# EAGLE design Volt4-leds (EAGLE 7.2.0)
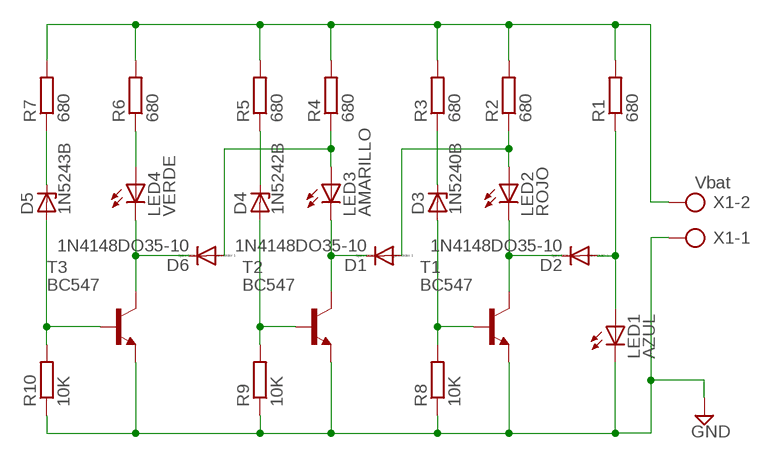
[diagram p0: schematic, sheet 1]

## Parts
D1  1N4148DO35-10  [DO35-10]
D2  1N4148DO35-10  [DO35-10]
D3  1N5240B  ZENER-DIODEDO35Z10  [DO35Z10]
D4  1N5242B  ZENER-DIODEDO35Z10  [DO35Z10]
D5  1N5243B  ZENER-DIODEDO35Z10  [DO35Z10]
D6  1N4148DO35-10  [DO35-10]
LED1  AZUL  LED3MM  [LED3MM]
LED2  ROJO  LED3MM  [LED3MM]
LED3  AMARILLO  LED3MM  [LED3MM]
LED4  VERDE  LED3MM  [LED3MM]
R1  680  R-EU_0207/10  [0207/10]
R2  680  R-EU_0207/10  [0207/10]
R3  680  R-EU_0207/10  [0207/10]
R4  680  R-EU_0207/10  [0207/10]
R5  680  R-EU_0207/10  [0207/10]
R6  680  R-EU_0207/10  [0207/10]
R7  680  R-EU_0207/10  [0207/10]
R8  10K  R-EU_0207/10  [0207/10]
R9  10K  R-EU_0207/10  [0207/10]
R10  10K  R-EU_0207/10  [0207/10]
T1  BC547  [TO92]
T2  BC547  [TO92]
T3  BC547  [TO92]
X1  Vbat  AK500/2  [AK500/2]

## Nets
GND: LED1.K(C) R8.1 R9.1 R10.1 T1.1(E) T2.1(E) T3.1(E) X1.1
N$1: R1.2 R2.2 R3.2 R4.2 R5.2 R6.2 R7.2 X1.2
N$2: D3.C R3.1
N$3: D1.A LED2.A R2.1
N$4: D2.C LED2.K(C) T1.3(C)
N$5: D3.A R8.2 T1.2(B)
N$6: D5.A R10.2 T3.2(B)
N$7: D4.A R9.2 T2.2(B)
N$9: D1.C LED3.K(C) T2.3(C)
N$10: D6.A LED3.A R4.1
N$11: D4.C R5.1
N$13: D6.C LED4.K(C) T3.3(C)
N$14: LED4.A R6.1
N$15: D5.C R7.1
N$17: D2.A LED1.A R1.1

## Library data of the parts
D1 D2 D6 = diode:1N4148: DIODE high speed (Philips)
D3-D5 = diode:ZENER-DIODE: Z-Diode
LED1-LED4 = led:LED: LED OSRAM: - CHIPLED LG R971, LG N971, LY N971, LG Q971, LY Q971, LO R971, LY R971 LH N974, LH R974 LS Q976, LO Q976, LY Q976 LO Q996 - Hyper CHIPLED LW Q18S LB Q993, LB Q99A, LB R99A - SideLED LS A670, LO A670, LY A670, LG A670, LP A670 LB A673, LV A673, LT A673, LW A673 LH A674 LY A675 LS A676, LA A676, LO A676, LY A676, LW A676 LS A679, LY A679, LG A679 - Hyper Micro SIDELED® LS Y876, LA Y876, LO Y876, LY Y876 LT Y87S - SmartLED LW L88C, LW L88S LB L89C, LB L89S, LG L890 LS L89K, LO L89K, LY L89K LS L896, LA L896, LO L896, LY L896 - TOPLED LS T670, LO T670, LY T670, LG T670, LP T670 LSG T670, LSP T670, LSY T670, LOP T670, LYG T670 LG T671, LOG T671, LSG T671 LB T673, LV T673, LT T673, LW T673 LH T674 LS T676, LA T676, LO T676, LY T676, LB T676, LH T676, LSB T676, LW T676 LB T67C, LV T67C, LT T67C, LS T67K, LO T67K, LY T67K, LW E67C LS E67B, LA E67B, LO E67B, LY E67B, LB E67C, LV E67C, LT E67C LW T67C LS T679, LY T679, LG T679 LS T770, LO T770, LY T770, LG T770, LP T770 LB T773, LV T773, LT T773, LW T773 LH T774 LS E675, LA E675, LY E675, LS T675 LS T776, LA T776, LO T776, LY T776, LB T776 LHGB T686 LT T68C, LB T68C - Hyper Mini TOPLED® LB M676 - Mini TOPLED Santana® LG M470 LS M47K, LO M47K, LY M47K Source: http://www.osram.convergy.de LUXEON: - LUMILED® LXK2-PW12-R00, LXK2-PW12-S00, LXK2-PW14-U00, LXK2-PW14-V00 LXK2-PM12-R00, LXK2-PM12-S00, LXK2-PM14-U00 LXK2-PE12-Q00, LXK2-PE12-R00, LXK2-PE12-S00, LXK2-PE14-T00, LXK2-PE14-U00 LXK2-PB12-K00, LXK2-PB12-L00, LXK2-PB12-M00, LXK2-PB14-N00, LXK2-PB14-P00, LXK2-PB14-Q00 LXK2-PR12-L00, LXK2-PR12-M00, LXK2-PR14-Q00, LXK2-PR14-R00 LXK2-PD12-Q00, LXK2-PD12-R00, LXK2-PD12-S00 LXK2-PH12-R00, LXK2-PH12-S00 LXK2-PL12-P00, LXK2-PL12-Q00, LXK2-PL12-R00 Source: www.luxeon.com KINGBRIGHT: KA-3528ASYC Source: www.kingbright.com
R1-R10 = resistor:R-EU_: RESISTOR, European symbol
T1-T3 = transistor:BC547: NPN TRANSISTOR
X1 = con-ptr500:AK500/2: CONNECTOR; OC_FARNELL: unknown; OC_NEWARK: unknown

## Board
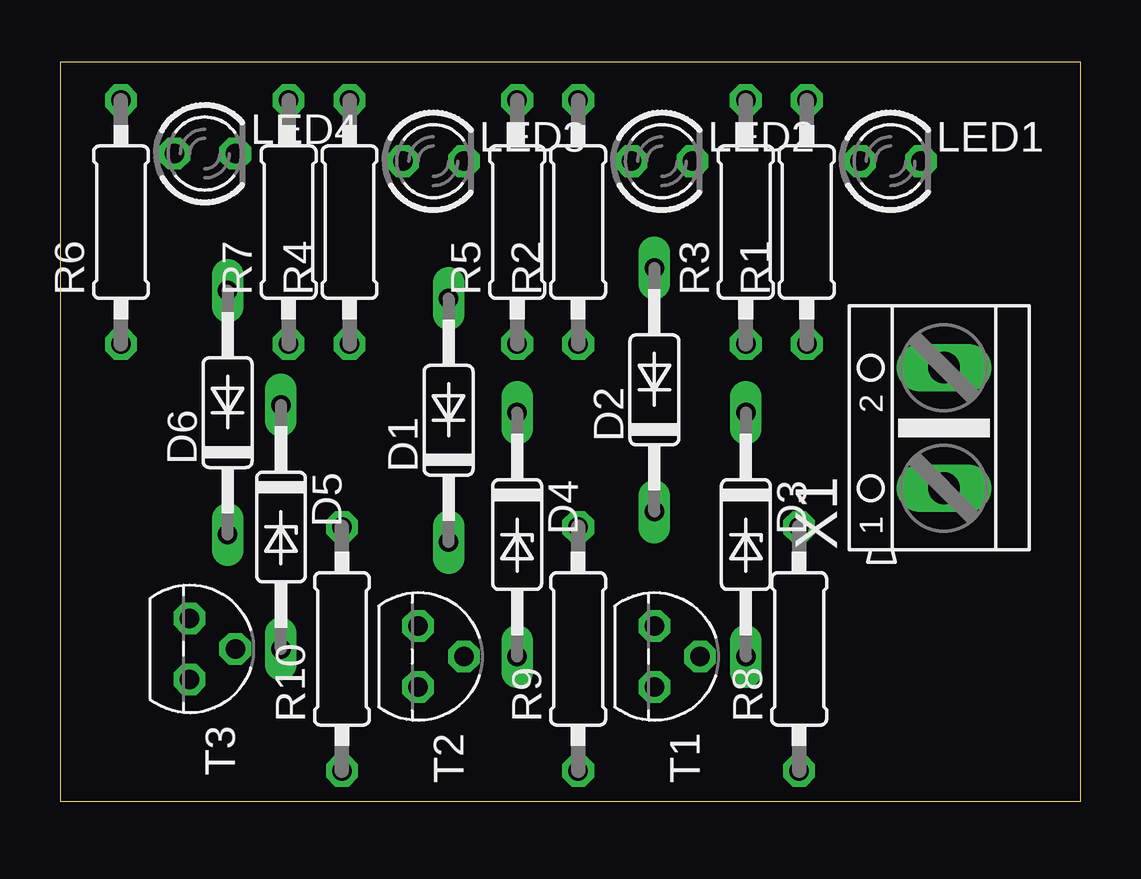
[diagram p1: board, top side]
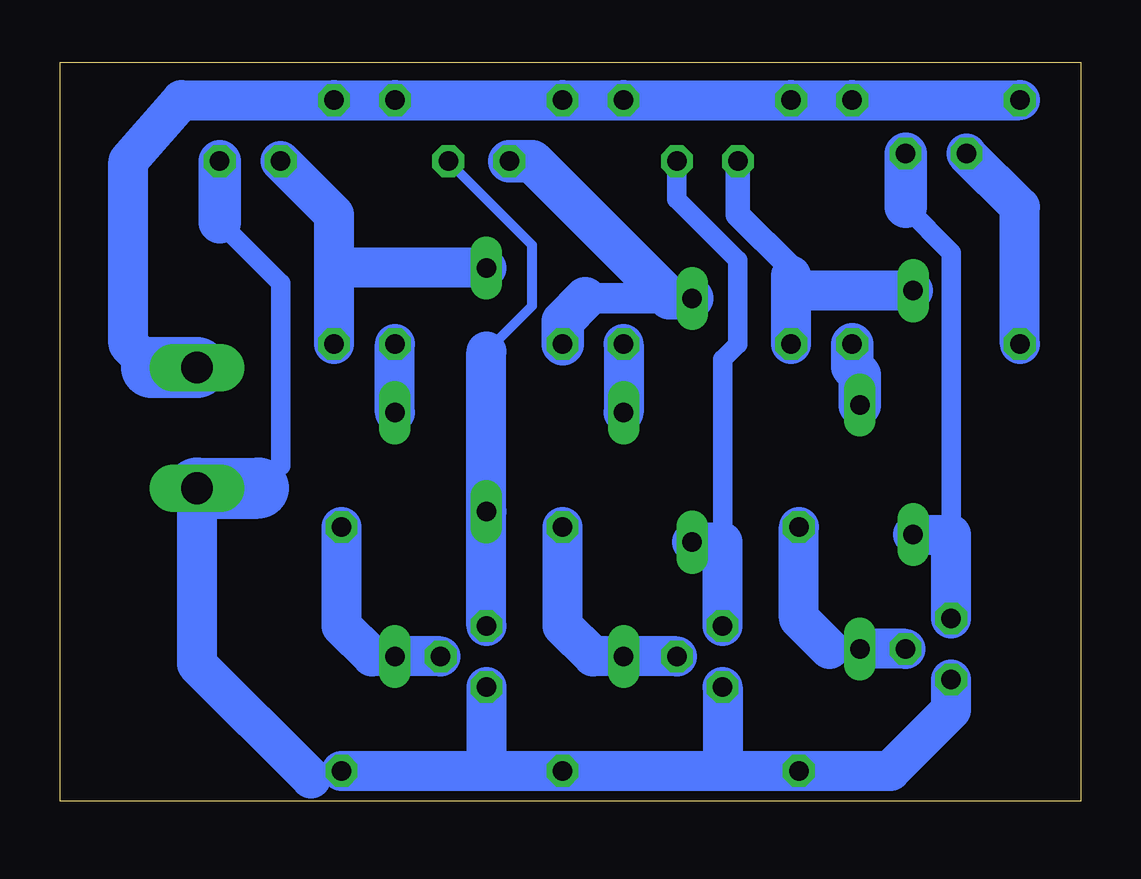
[diagram p2: board, bottom side, seen from below]

Size 42.53 x 30.79 mm. Coordinates in mm from the lower left corner, seen from the top.
Outline: 0,0 42.53,0 42.53,30.79 0,30.79 0,0
Copper layers (1*16): Top 0.035mm / dielectric 1.5mm / Bottom 0.035mm
Design rules "default": minimum track width 10mil, minimum drill 24mil, track to track 8mil, track to pad 8mil, pad to pad 8mil, via to via 8mil, smd to smd 8mil, copper to edge 40mil, drill to drill 8mil, minimum pad ring 10mil, minimum via ring 8mil, stop-mask expansion 4mil, vias tented up to drill 0mil, thermal gap 10mil

### Footprints (pad centres in the part's own frame; a part is rotated, then mirrored left to right if it is on the bottom)
DO35-10 = drill 0.813 long: A 5.08,0; C -5.08,0
DO35Z10 = drill 0.813 long: A 5.08,0; C -5.08,0
LED3MM = drill 0.813 octagon: A -1.27,0; K 1.27,0
0207/10 = drill 0.813 octagon: 1 -5.08,0; 2 5.08,0
TO92 = drill 0.813 octagon: 1 1.27,0; 2 0,1.905; 3 -1.27,0
AK500/2 = drill 1.321 long: 1 -2.515,0; 2 2.515,0

### Placement (x,y rotation side)
D1  16.19,15.88 90 top
D2  24.77,17.14 90 top
D3  [DO35Z10]  28.57,11.11 270 top
D4  [DO35Z10]  19.05,11.11 270 top
D5  [DO35Z10]  9.21,11.43 270 top
D6  6.99,16.19 90 top
LED1  [LED3MM]  34.61,26.67 0 top
LED2  [LED3MM]  25.08,26.67 0 top
LED3  [LED3MM]  15.56,26.67 0 top
LED4  [LED3MM]  6.03,26.99 0 top
R1  [0207/10]  31.11,24.13 90 top
R2  [0207/10]  21.59,24.13 90 top
R3  [0207/10]  28.57,24.13 90 top
R4  [0207/10]  12.06,24.13 90 top
R5  19.05,24.13 90 top
R6  2.54,24.13 90 top
R7  9.53,24.13 90 top
R8  [0207/10]  30.8,6.35 90 top
R9  [0207/10]  21.59,6.35 90 top
R10  [0207/10]  11.75,6.35 90 top
T1  24.77,6.03 270 top
T2  14.92,6.03 270 top
T3  5.4,6.35 270 top
X1  36.83,15.56 90 top

### Tracks (layer width: path | path; a pad name or v marks a point on that pad's centre or on a via)
GND
  Bottom 0.406: 32.07,0.95 31.11,0.95 R8.1 | 14.92,1.59 15.24,1.27 | 24.77,1.59 25.08,1.27
  Bottom 0.813: 34.27,13.04 33.34,13.97 33.34,21.59 35.88,24.13
  Bottom 1.676: X1.1 36.83,5.71 32.07,0.95 | R8.1 25.08,1.27 R9.1 15.24,1.27 R10.1 7.94,1.27 5.4,3.81 T3.1 | T2.1 14.92,1.59 | T1.1 24.77,1.59
  Bottom 1.778: 35.88,24.13 LED1.K
  Bottom 2.54: X1.1 34.27,13.04
N$1
  Bottom 1.676: 38.71,18.07 39.69,19.05 39.69,26.67 37.47,29.21 R1.2 R3.2 R2.2 R5.2 R4.2 R7.2 R6.2
  Bottom 2.54: X1.2 38.71,18.07
N$2
  Bottom 1.676: D3.C R3.1
N$3
  Bottom 1.27: 20.64,20.95 17.14,20.95
  Bottom 1.778: D1.A 17.14,20.95 22.86,26.67 LED2.A | R2.1 21.59,20 20.64,20.95
N$4
  Bottom 0.406: 24.77,18.73 22.86,20.64 22.86,23.18 LED2.K
  Bottom 1.676: T1.3 D2.C 24.77,18.73
N$5
  Bottom 0.406: T1.2 D3.A
  Bottom 1.676: T1.2 29.53,6.03 30.8,7.3 R8.2
N$6
  Bottom 0.406: D5.A 10.48,6.35
  Bottom 1.676: T3.2 D5.A | 10.48,6.35 11.75,7.62 R10.2
N$7
  Bottom 1.676: T2.2 D4.A 20.32,6.03 21.59,7.3 R9.2
N$9
  Bottom 0.813: 14.92,10.79 14.92,18.41 14.29,19.05 14.29,22.54 16.83,25.08 LED3.K
  Bottom 1.676: T2.3 14.92,10.79 D1.C
N$10
  Bottom 0.406: 12.06,22.23 12.06,21.91 11.43,21.27
  Bottom 1.016: 12.06,22.23 14.29,24.45 LED3.A
  Bottom 1.676: R4.1 12.06,21.91 | D6.A 11.43,21.27
N$11
  Bottom 1.676: R5.1 D4.C
N$13
  Bottom 0.813: 5.4,11.11 5.4,22.86 7.3,24.77
  Bottom 1.676: T3.3 5.4,11.11 D6.C
  Bottom 1.778: 7.3,24.77 LED4.K
N$14
  Bottom 1.676: R6.1 2.54,24.77 LED4.A
N$15
  Bottom 1.778: D5.C 9.21,17.78 9.53,18.1 R7.1
N$17
  Bottom 1.676: R1.1 31.11,22.23 | 31.11,22.23 31.11,24.45 LED1.A | D2.A 31.11,22.23